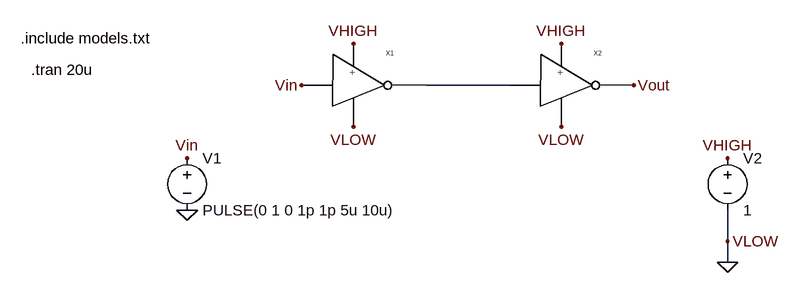
[diagram p0: schematic inverter_test.asc]
inverter_test.asc, the LTspice schematic file:
Version 4
SHEET 1 880 680
WIRE 352 160 224 160
WIRE 688 400 688 352
WIRE 688 432 688 400
FLAG 32 160 Vin
FLAG 544 160 Vout
FLAG 112 96 VHIGH
FLAG 432 96 VHIGH
FLAG 112 224 VLOW
FLAG 432 224 VLOW
FLAG -144 272 Vin
FLAG -144 352 0
FLAG 688 432 0
FLAG 688 272 VHIGH
FLAG 688 400 VLOW
SYMBOL inverter 112 160 R0
SYMATTR InstName X1
SYMBOL inverter 432 160 R0
SYMATTR InstName X2
SYMBOL voltage -144 256 R0
WINDOW 123 0 0 Left 0
WINDOW 39 0 0 Left 0
SYMATTR InstName V1
SYMATTR Value PULSE(0 1 0 1p 1p 5u 10u)
SYMBOL voltage 688 256 R0
WINDOW 123 0 0 Left 0
WINDOW 39 0 0 Left 0
SYMATTR InstName V2
SYMATTR Value 1
TEXT -400 88 Left 2 !.include models.txt
TEXT -384 136 Left 2 !.tran 20u

The netlist it stands for:
* inverter_test.asc
XX1 Vin VHIGH 0 N001 inverter  ; pins Vin VHIGH VLOW Vout
XX2 N001 VHIGH 0 Vout inverter  ; pins Vin VHIGH VLOW Vout
V1 Vin 0 PULSE(0 1 0 1p 1p 5u 10u)
V2 VHIGH 0 1
.include models.txt
.tran 20u
.backanno
.end